# Altium schematic sheet saliya.SchDoc
size A; SheetNumber: 5; SheetTotal: 5
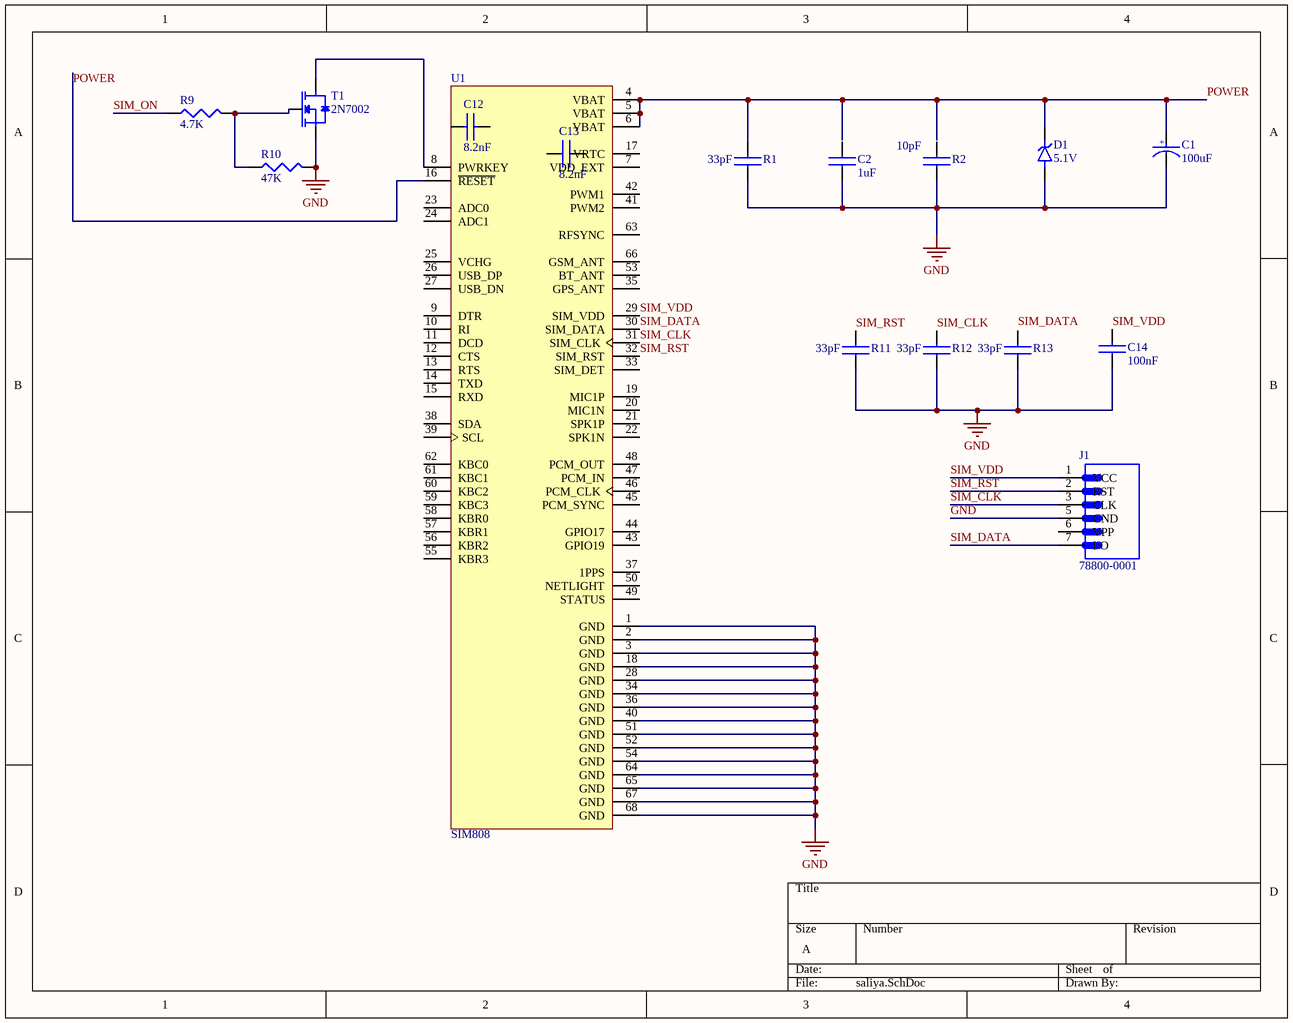
[diagram p0: saliya.SchDoc]

## Parts
C1  100uF  [C_ALU_C_SIZE]
C2  1uF  [C0805]
C12  8.2nF  [C0805]
C13  8.2nF  [C0805]
C14  100nF  [C0805]
D1  5.1V  [SOD323]
J1  78800-0001  [SIM]
R1  33pF  [C0805]
R2  10pF  [C0805]
R9  4.7K  [R0805]
R10  47K  [R0805]
R11  33pF  [C0805]
R12  33pF  [C0805]
R13  33pF  [C0805]
T1  2N7002  [TRANS_MMBT2907A]
U1  SIM808  [XCVR_SIM808]

## Nets
GND: C1.2 C2.1 C14.1 D1.A J1.5(GND) R1.1 R2.1 R10.2 R11.1 R12.1 R13.1 T1.1 U1.1(GND) U1.2(GND) U1.3(GND) U1.18(GND) U1.28(GND) U1.34(GND) U1.36(GND) U1.40(GND) U1.51(GND) U1.52(GND) U1.54(GND) U1.64(GND) U1.65(GND) U1.67(GND) U1.68(GND)
POWER: C1.1 D1.C(K) R1.2 U1.4(VBAT) U1.5(VBAT) U1.6(VBAT) U1.16(~{RESET})
SIM_CLK: J1.3(CLK) R12.2 U1.31(SIM_CLK)
SIM_DATA: J1.7(I/O) U1.30(SIM_DATA)
SIM_ON: R9.1
SIM_RST: J1.2(RST) R11.2 U1.32(SIM_RST)
SIM_VDD: C14.2 J1.1(VCC) U1.29(SIM_VDD)
NetR9_2: R9.2 R10.1 T1.3
NetT1_2: T1.2 U1.8(PWRKEY)

Not connected (* = marked no-connect by the designer): C2 2; C12 1 2; C13 1 2; J1 6(VPP); R2 2; R13 2; U1 7(VDD_EXT) 9(DTR) 10(RI) 11(DCD) 12(CTS) 13(RTS) 14(TXD) 15(RXD) 17(VRTC) 19(MIC1P) 20(MIC1N) 21(SPK1P) 22(SPK1N) 23(ADC0) 24(ADC1) 25(VCHG) 26(USB_DP) 27(USB_DN) 33(SIM_DET) 35(GPS_ANT) 37(1PPS) 38(SDA) 39(SCL) 41(PWM2) 42(PWM1) 43(GPIO19) 44(GPIO17) 45(PCM_SYNC) 46(PCM_CLK) 47(PCM_IN) 48(PCM_OUT) 49(STATUS) 50(NETLIGHT) 53(BT_ANT) 55(KBR3) 56(KBR2) 57(KBR1) 58(KBR0) 59(KBC3) 60(KBC2) 61(KBC1) 62(KBC0) 63(RFSYNC) 66(GSM_ANT)

## Notes on the sheet
- Labels drawn without touching a wire or pin: SIM_DATA
- (in symbol EEE-1AA101WR) +

## Library data of the parts
C1 = EEE-1AA101WR: Cap Aluminum 100uF 10V 20% (5 X 5.4mm) SMD 50mA 1000 hr 85°C T/R; Manufacturer: Panasonic; Life (Hours): 1000Hour; Supplier 1: RSComponents; Manufacturer Part Number: EEE-1AA101WR; RoHS: Yes; Category: Aluminum Electrolytic Capacitors; Stock 1: 1; Pricing 1: 1000=0.07800, 3000=0.07400 (USD); Mount: Surface Mount,PCB; Case/Package: Radial; Contact Plating: Tin; Min Operating Temperature: -40°C; Max Operating Temperature: 85°C; Capacitance: 100uF; Tolerance: 20%; Ripple Current: 50mA; Voltage Rating: 10V; Packaging: Tape and Reel; Package Quantity: 1; Voltage Rating (DC): 10V; Termination: SMD/SMT; Ripple Current (AC): 50mA; Series: S; Construction: Cylindrical; Diameter: 5mm; Length: 5.5mm; Height: 5.4mm; Height - Seated (Max): 0.213inch; Radiation Hardening: No; Lead Free: Lead Free; RoHS Compliant: Yes; REACH SVHC: Unknown; ComponentLink1URL: https://datasheet.ciiva.com/26945/getdatasheetpartid-169213-26945071.pdf?src-supplier=Verical; ComponentLink1Description: https://datasheet.ciiva.com/26945/getdatasheetpartid-169213-26945071.pdf?src-supplier=Verical; ComponentLink2URL: https://datasheet.ciiva.com/24027/aba0000ce2-40801-24027541.pdf?src-supplier=Mouser; ComponentLink2Description: https://datasheet.ciiva.com/24027/aba0000ce2-40801-24027541.pdf?src-supplier=Mouser; ComponentLink3URL: https://datasheet.ciiva.com/14598/70255710-14598233.pdf?src-supplier=Allied+Electronics; ComponentLink3Description: https://datasheet.ciiva.com/14598/70255710-14598233.pdf?src-supplier=Allied+Electronics; ComponentLink4URL: https://datasheet.ciiva.com/14605/70255710-14605689.pdf?src-supplier=Allied+Electronics; ComponentLink4Description: https://datasheet.ciiva.com/14605/70255710-14605689.pdf?src-supplier=Allied+Electronics; ComponentLink5URL: https://datasheet.ciiva.com/11673/aba0000ce2-11673882.pdf?src-supplier=Avnet; ComponentLink5Description: https://datasheet.ciiva.com/11673/aba0000ce2-11673882.pdf?src-supplier=Avnet; ComponentLink6URL: https://datasheet.ciiva.com/16427/aba0000ce2-16427544.pdf?src-supplier=Future+Electronics; ComponentLink6Description: https://datasheet.ciiva.com/16427/aba0000ce2-16427544.pdf?src-supplier=Future+Electronics; ComponentLink7URL: https://datasheet.ciiva.com/2983/aba0000ce2-2983906.pdf?src-supplier=Avnet; ComponentLink7Description: https://datasheet.ciiva.com/2983/aba0000ce2-2983906.pdf?src-supplier=Avnet; ComponentLink8URL: https://datasheet.ciiva.com/30075/11aba0000ce2-30075303.pdf?src-supplier=Onlinecomponents.com; ComponentLink8Description: https://datasheet.ciiva.com/30075/11aba0000ce2-30075303.pdf?src-supplier=Onlinecomponents.com; Supplier Part Number 1: 1763738
C2 = GRM21BR71H105KA12L: 0805 1 uF 50 V ±10% Tolerance X7R Multilayer Ceramic Chip Capacitor; Manufacturer: Murata; Voltage Rating: 50V; Supplier 1: Newark; Manufacturer Part Number: GRM21BR71H105KA12L; RoHS: Yes; Category: Ceramic Capacitors; Pricing 1: 1=0.72300, 25=0.64900, 50=0.59100, 100=0.52300, 250=0.46500, 500=0.39900, 1000=0.35100, 2500=0.27800, 3000=0.27800 (USD); Mount: Surface Mount; Case/Package: 0805; Number of Pins: 2; Case Code (Metric): 2012; Case Code (Imperial): 0805; Material: Ceramic; Min Operating Temperature: -55°C; Max Operating Temperature: 125°C; Capacitance: 1uF; Tolerance: 10%; Packaging: Tape and Reel; Package Quantity: 1; Voltage Rating (DC): 50V; Termination: SMD/SMT; Series: GRM; Dielectric: X7R; Construction: Flat; Voltage: 50V; Length: 2mm; Width: 0.049inch; Height: 1.25mm; Depth: 1.25mm; Thickness: 0.053inch; Radiation Hardening: No; RoHS Compliant: Yes; Reach SVHC Compliant: Yes; Lead Free: Lead Free; ComponentLink1URL: https://datasheet.ciiva.com/22774/1747475-22774409.pdf?src-supplier=Farnell; ComponentLink1Description: https://datasheet.ciiva.com/22774/1747475-22774409.pdf?src-supplier=Farnell; ComponentLink2URL: https://datasheet.ciiva.com/28659/1684872-28659460.pdf?src-supplier=Element14; ComponentLink2Description: https://datasheet.ciiva.com/28659/1684872-28659460.pdf?src-supplier=Element14; ComponentLink3URL: https://datasheet.ciiva.com/139/grm21br71h105ka12-139467.pdf?src-supplier=Digi-Key; ComponentLink3Description: https://datasheet.ciiva.com/139/grm21br71h105ka12-139467.pdf?src-supplier=Digi-Key; ComponentLink4URL: https://datasheet.ciiva.com/3777/8166grm21br71h105ka1223-3777308.pdf?src-supplier=Arrow+Electronics; ComponentLink4Description: https://datasheet.ciiva.com/3777/8166grm21br71h105ka1223-3777308.pdf?src-supplier=Arrow+Electronics; ComponentLink5URL: https://datasheet.ciiva.com/29202/450841-da-01-de-vs-chip-kond-0805-1-0-uf-10pr-50-0v-x7r-29202833.pdf?src-supplier=Conrad; ComponentLink5Description: https://datasheet.ciiva.com/29202/450841-da-01-de-vs-chip-kond-0805-1-0-uf-10pr-50-0v-x7r-29202833.pdf?src-supplier=Conrad; ComponentLink6URL: https://datasheet.ciiva.com/29199/454791-da-01-en-vs-kondensator-0805-29199539.pdf?src-supplier=Conrad; ComponentLink6Description: https://datasheet.ciiva.com/29199/454791-da-01-en-vs-kondensator-0805-29199539.pdf?src-supplier=Conrad; ComponentLink7URL: https://datasheet.ciiva.com/22774/608985-22774412.pdf?src-supplier=Farnell; ComponentLink7Description: https://datasheet.ciiva.com/22774/608985-22774412.pdf?src-supplier=Farnell; ComponentLink8URL: https://datasheet.ciiva.com/22774/608985-22774411.pdf?src-supplier=Farnell; ComponentLink8Description: https://datasheet.ciiva.com/22774/608985-22774411.pdf?src-supplier=Farnell; ComponentLink9URL: https://datasheet.ciiva.com/16199/product-16199127.pdf?src-supplier=Future+Electronics; ComponentLink9Description: https://datasheet.ciiva.com/16199/product-16199127.pdf?src-supplier=Future+Electronics
C12 C13 = C0805X822F4HAC7800: CAP CER 0805 8.2NF 16V ULTRA STA; Manufacturer: KEMET; Manufacturer Part Number: C0805X822F4HAC7800; RoHS: No; Category: Ceramic Capacitors; Supplier 1: Digi-Key; Supplier Part Number 1: C0805X822F4HAC7800-ND
C14 = CGA4J2X7R1H104K125AM: Cap Ceramic 0.1uF 50V X7R 10% Pad SMD 0805 125°C Automotive T/R; Manufacturer: TDK; Supplier 1: Digi-Key; Manufacturer Part Number: CGA4J2X7R1H104K125AM; RoHS: Yes; Category: Ceramic Capacitors; Stock 1: 4940; Pricing 1: 1=0.20000, 10=0.14200, 50=0.08080, 100=0.06700, 500=0.04696, 1000=0.03888 (USD); Mount: Surface Mount; Case/Package: 0805; Case Code (Metric): 2012; Case Code (Imperial): 0805; Weight: 0.000194oz; Min Operating Temperature: -55°C; Max Operating Temperature: 125°C; Capacitance: 100nF; Voltage Rating: 50V; Tolerance: 10%; Packaging: Tape and Reel; Termination: SMD/SMT; Series: CGA; Package Quantity: 1; Voltage Rating (DC): 50V; Dielectric: X7R; Resistor Type: Ceramic; Features: Soft Termination; Length: 0.079inch; Width: 0.049inch; Height: 1.25mm; Thickness: 0.057inch; Depth: 1.25mm; Ratings: AEC-Q200; RoHS Compliant: Yes; ComponentLink1URL: http://components.arrow.com/part/dataview/0323_06888403?src-supplier=Arrow+Europe; ComponentLink1Description: http://components.arrow.com/part/dataview/0323_06888403?src-supplier=Arrow+Europe; ComponentLink2URL: https://product.tdk.com/info/en/catalog/datasheets/mlcc_automotive_openmode_en.pdf?src-supplier=Digi-Key; ComponentLink2Description: https://product.tdk.com/info/en/catalog/datasheets/mlcc_automotive_openmode_en.pdf?src-supplier=Digi-Key; ComponentLink3URL: https://product.tdk.com/info/en/documents/chara_sheet/CGA4J2X7R1H104K125AM.pdf?src-supplier=Digi-Key; ComponentLink3Description: https://product.tdk.com/info/en/documents/chara_sheet/CGA4J2X7R1H104K125AM.pdf?src-supplier=Digi-Key; ComponentLink4URL: http://components.arrow.com/part/dataview/57437351S460182N1165?src-supplier=Arrow+Electronics; ComponentLink4Description: http://components.arrow.com/part/dataview/57437351S460182N1165?src-supplier=Arrow+Electronics; Supplier Part Number 1: 445-6958-1-ND
D1 = BZT52C5V1S: Zener Single Diode, 5.1 V, 200 Mw, Sod-323, 6 %, 2, 150 C Rohs Compliant: Yes; Manufacturer: Multicomp; Max Power Dissipation: 200mW; Test Current: 5mA; Forward Voltage: 900mV; Max Forward Surge Current (Ifsm): 2A; Supplier 1: Farnell; Manufacturer Part Number: BZT52C5V1S; RoHS: Yes; Category: Zener Diodes; Mount: Surface Mount; Number of Pins: 2; Min Operating Temperature: -65°C; Max Operating Temperature: 150°C; Zener Voltage: 5.1V; Packaging: Cut Tape; Termination: SMD/SMT; Reach SVHC Compliant: Yes; ComponentLink1URL: http://www.farnell.com/datasheets/469132.pdf?src-supplier=Farnell; ComponentLink1Description: http://www.farnell.com/datasheets/469132.pdf?src-supplier=Farnell; ComponentLink2URL: http://www.farnell.com/datasheets/469132.pdf?src-supplier=Element14; ComponentLink2Description: http://www.farnell.com/datasheets/469132.pdf?src-supplier=Element14
J1 = 78800-0001: Vertical Surface Mount Memory & SIM Card Connector; with SMT Termination; Manufacturer: Molex; Number of Contacts: 6; Connector Type: Socket; Current Rating: 500mA; Gender: Female; Voltage Rating (DC): 5V; Shielding: Shielded; Pitch: 1.4mm; Supplier 1: RSComponents; Manufacturer Part Number: 78800-0001; RoHS: Yes; Category: Memory Connectors; Stock 1: 1295; Pricing 1: 5=1.42600, 25=1.35800, 50=1.28600, 125=1.18000, 250=1.07600 (GBP); Mount: Surface Mount; Contact Material: Bronze; Contact Plating: Gold; Housing Material: Polymer; Material: Bronze; Min Operating Temperature: -30°C; Max Operating Temperature: 85°C; Packaging: Tape and Reel; Series: 78800; Package Quantity: 1200; Termination: SMD/SMT; Number of Rows: 1; Orientation: Vertical; Number of Circuits: 6; Length: 16.96mm; Height: 1.4mm; RoHS Compliant: Yes; Halogen Free: Low Halogen; ELV: Compliant; ComponentLink1URL: https://datasheet.ciiva.com/28461/1769838-28461586.pdf?src-supplier=Element14; ComponentLink1Description: https://datasheet.ciiva.com/28461/1769838-28461586.pdf?src-supplier=Element14; ComponentLink2URL: https://datasheet.ciiva.com/30490/0900766b812787b6-30490685.pdf?src-supplier=RSComponents; ComponentLink2Description: https://datasheet.ciiva.com/30490/0900766b812787b6-30490685.pdf?src-supplier=RSComponents; ComponentLink3URL: https://datasheet.ciiva.com/23829/0788000001-memory-card-socket-23829351.pdf?src-supplier=Newark; ComponentLink3Description: https://datasheet.ciiva.com/23829/0788000001-memory-card-socket-23829351.pdf?src-supplier=Newark; ComponentLink4URL: https://datasheet.ciiva.com/24089/0788000001-memory-card-socket-253493-24089694.pdf?src-supplier=Mouser; ComponentLink4Description: https://datasheet.ciiva.com/24089/0788000001-memory-card-socket-253493-24089694.pdf?src-supplier=Mouser; ComponentLink5URL: https://datasheet.ciiva.com/28461/1769838-28461580.pdf?src-supplier=Element14; ComponentLink5Description: https://datasheet.ciiva.com/28461/1769838-28461580.pdf?src-supplier=Element14
R1 R11-R13 = CC0805JRNPO9BN330: 0805 33 pF 50 V ±5 % Tolerance NP0 SMT Multilayer Ceramic Capacitor; Manufacturer: Yageo; Tolerance: 5%; Dielectric: C0G; Voltage: 50V; Supplier 1: Arrow Electronics; Manufacturer Part Number: CC0805JRNPO9BN330; RoHS: Yes; Category: Ceramic Capacitors; Stock 1: 9; Pricing 1: 1=0.08810, 10=0.07140, 25=0.06280, 100=0.03650, 250=0.03610, 500=0.03580, 1000=0.02670, 3000=0.01560 (USD); Mount: Surface Mount; Case/Package: 0805; Material: Ceramic; Case Code (Imperial): 0805; Case Code (Metric): 2012; Dielectric Material: Ceramic; Min Operating Temperature: -55°C; Max Operating Temperature: 125°C; Capacitance: 33pF; Series: CC; Package Quantity: 1; Voltage Rating: 50V; Voltage Rating (DC): 50V; Packaging: Tape and Reel; Termination: SMD/SMT; Resistor Type: Ceramic; Length: 2mm; Width: 1.25mm; Height: 0.6mm; Depth: 1.25mm; Thickness: 0.024inch; Radiation Hardening: No; Reach SVHC Compliant: Unknown; Lead Free: Lead Free; RoHS Compliant: Yes; ComponentLink1URL: https://datasheet.ciiva.com/8033/1443161-8033944.pdf?src-supplier=Element14; ComponentLink1Description: https://datasheet.ciiva.com/8033/1443161-8033944.pdf?src-supplier=Element14; ComponentLink2URL: https://datasheet.ciiva.com/8033/1443161-8033942.pdf?src-supplier=Element14; ComponentLink2Description: https://datasheet.ciiva.com/8033/1443161-8033942.pdf?src-supplier=Element14; ComponentLink3URL: https://datasheet.ciiva.com/144/mlccorderingcode-144779.pdf?src-supplier=Digi-Key; ComponentLink3Description: https://datasheet.ciiva.com/144/mlccorderingcode-144779.pdf?src-supplier=Digi-Key; ComponentLink4URL: https://datasheet.ciiva.com/144/mlccorderingcode-144778.pdf?src-supplier=Digi-Key; ComponentLink4Description: https://datasheet.ciiva.com/144/mlccorderingcode-144778.pdf?src-supplier=Digi-Key; ComponentLink5URL: https://datasheet.ciiva.com/144/mlccorderingcode-144780.pdf?src-supplier=Digi-Key; ComponentLink5Description: https://datasheet.ciiva.com/144/mlccorderingcode-144780.pdf?src-supplier=Digi-Key; ComponentLink6URL: https://datasheet.ciiva.com/11464/upy-gp-np0-16v-to-50v-8-11464747.pdf?src-supplier=Avnet; ComponentLink6Description: https://datasheet.ciiva.com/11464/upy-gp-np0-16v-to-50v-8-11464747.pdf?src-supplier=Avnet; ComponentLink7URL: https://datasheet.ciiva.com/29241/445349-da-01-en-kerko-chip-0805-np0-33pf-5proz-50v-g-29241975.pdf?src-supplier=Conrad; ComponentLink7Description: https://datasheet.ciiva.com/29241/445349-da-01-en-kerko-chip-0805-np0-33pf-5proz-50v-g-29241975.pdf?src-supplier=Conrad
R2 = CC0805JRNPO9BN100: Surface Mount Ceramic Multilayer Capacitor 10pF 5% C0G 50V 0805 Paper T/R; Manufacturer: Yageo; Supplier 1: RSComponents; Manufacturer Part Number: CC0805JRNPO9BN100; RoHS: Yes; Category: Ceramic Capacitors; Stock 1: 3250; Pricing 1: 250=0.02400, 1000=0.01800, 2000=0.01700 (GBP); Mount: Surface Mount; Case/Package: 0805; Number of Pins: 2; Material: Ceramic; Case Code (Metric): 2012; Case Code (Imperial): 0805; Min Operating Temperature: -55°C; Max Operating Temperature: 125°C; Capacitance: 10pF; Tolerance: 5%; Dielectric: C0G; Package Quantity: 1; Voltage Rating: 50V; Packaging: Tape and Reel; Voltage Rating (DC): 50V; Termination: SMD/SMT; Resistor Type: Ceramic; Series: CC; Length: 2mm; Width: 0.049inch; Height: 0.6mm; Depth: 1.25mm; Thickness: 0.024inch; Radiation Hardening: No; RoHS Compliant: Yes; Lead Free: Lead Free; ComponentLink1URL: https://datasheet.ciiva.com/144/mlccorderingcode-144671.pdf?src-supplier=Digi-Key; ComponentLink1Description: https://datasheet.ciiva.com/144/mlccorderingcode-144671.pdf?src-supplier=Digi-Key; ComponentLink2URL: https://datasheet.ciiva.com/144/mlccorderingcode-144670.pdf?src-supplier=Digi-Key; ComponentLink2Description: https://datasheet.ciiva.com/144/mlccorderingcode-144670.pdf?src-supplier=Digi-Key; ComponentLink3URL: https://datasheet.ciiva.com/144/mlccorderingcode-144672.pdf?src-supplier=Digi-Key; ComponentLink3Description: https://datasheet.ciiva.com/144/mlccorderingcode-144672.pdf?src-supplier=Digi-Key; ComponentLink4URL: https://datasheet.ciiva.com/11464/upy-gp-np0-16v-to-50v-8-11464744.pdf?src-supplier=Avnet; ComponentLink4Description: https://datasheet.ciiva.com/11464/upy-gp-np0-16v-to-50v-8-11464744.pdf?src-supplier=Avnet
R9 = RC0805JR-074K7L: Res Thick Film 0805 4.7K Ohm 5% 0.125W(1/8W) ±100ppm/C Pad SMD T/R; Manufacturer: Yageo; Resistance: 4.7kR; Temperature Coefficient: 100ppm/°C; Power Rating: 125mW; Voltage Rating: 150V; Supplier 1: RSComponents; Manufacturer Part Number: RC0805JR-074K7L; RoHS: Yes; Category: Chip SMD Resistors; Stock 1: 17500; Pricing 1: 100=0.01400, 1000=0.01300, 2500=0.01200, 5000=0.01100, 10000=0.01000 (GBP); Case/Package: 0805; Contact Plating: Tin,Lead; Case Code (Imperial): 0805; Case Code (Metric): 2012; Size Code: 0805; Min Operating Temperature: -55°C; Max Operating Temperature: 155°C; Tolerance: 5%; Resistor Type: Thick Film; Packaging: Tape and Reel; Termination: SMD/SMT; Features: Moisture Resistant; Series: RC; Max Power Dissipation: 125mW; Number of Terminations: 2; Resistance Tolerance: 5%; Construction: Rectangular; Length: 2mm; Depth: 1.25mm; Radiation Hardening: No; Reach SVHC Compliant: Yes; Lead Free: Lead Free; Military Standard: Not; RoHS Compliant: Yes; ComponentLink1URL: https://datasheet.ciiva.com/12667/rc0805-12667037.pdf?src-supplier=Mouser; ComponentLink1Description: https://datasheet.ciiva.com/12667/rc0805-12667037.pdf?src-supplier=Mouser; ComponentLink2URL: https://datasheet.ciiva.com/7941/442941-7941974.pdf?src-supplier=Element14; ComponentLink2Description: https://datasheet.ciiva.com/7941/442941-7941974.pdf?src-supplier=Element14; ComponentLink3URL: https://datasheet.ciiva.com/7941/442941-7941973.pdf?src-supplier=Element14; ComponentLink3Description: https://datasheet.ciiva.com/7941/442941-7941973.pdf?src-supplier=Element14; ComponentLink4URL: https://datasheet.ciiva.com/17486/rc0805-17486827.pdf?src-supplier=Future+Electronics; ComponentLink4Description: https://datasheet.ciiva.com/17486/rc0805-17486827.pdf?src-supplier=Future+Electronics
R10 = RC0805JR-0747KL: Res Thick Film 0805 47K Ohm 5% 1/8W Ý100ppm/ÝC SMD Paper T/R; Manufacturer: Yageo; Resistance: 47kR; Temperature Coefficient: 100ppm/°C; Power Rating: 125mW; Voltage Rating: 150V; Supplier 1: Arrow Electronics; Manufacturer Part Number: RC0805JR-0747KL; RoHS: Yes; Category: Chip SMD Resistors; Stock 1: 6; Pricing 1: 1=0.03350 (USD); Case/Package: 0805; Contact Plating: Tin,Lead; Case Code (Imperial): 0805; Case Code (Metric): 2012; Size Code: 0805; Min Operating Temperature: -55°C; Max Operating Temperature: 155°C; Tolerance: 5%; Resistor Type: Thick Film; Packaging: Tape and Reel; Termination: SMD/SMT; Features: Moisture Resistant; Series: RC; Max Power Dissipation: 125mW; Number of Terminations: 2; Resistance Tolerance: 5%; Construction: Rectangular; Length: 2mm; Depth: 1.25mm; Radiation Hardening: No; Military Standard: Not; Lead Free: Lead Free; RoHS Compliant: Yes; ComponentLink1URL: https://datasheet.ciiva.com/7941/442941-7941967.pdf?src-supplier=Element14; ComponentLink1Description: https://datasheet.ciiva.com/7941/442941-7941967.pdf?src-supplier=Element14; ComponentLink2URL: https://datasheet.ciiva.com/17200/rc0805-17200744.pdf?src-supplier=Future+Electronics; ComponentLink2Description: https://datasheet.ciiva.com/17200/rc0805-17200744.pdf?src-supplier=Future+Electronics
T1 = 2N7002: Transistor Mosfet N-ch 60V 0.3A 3-PIN SOT-23 T/r